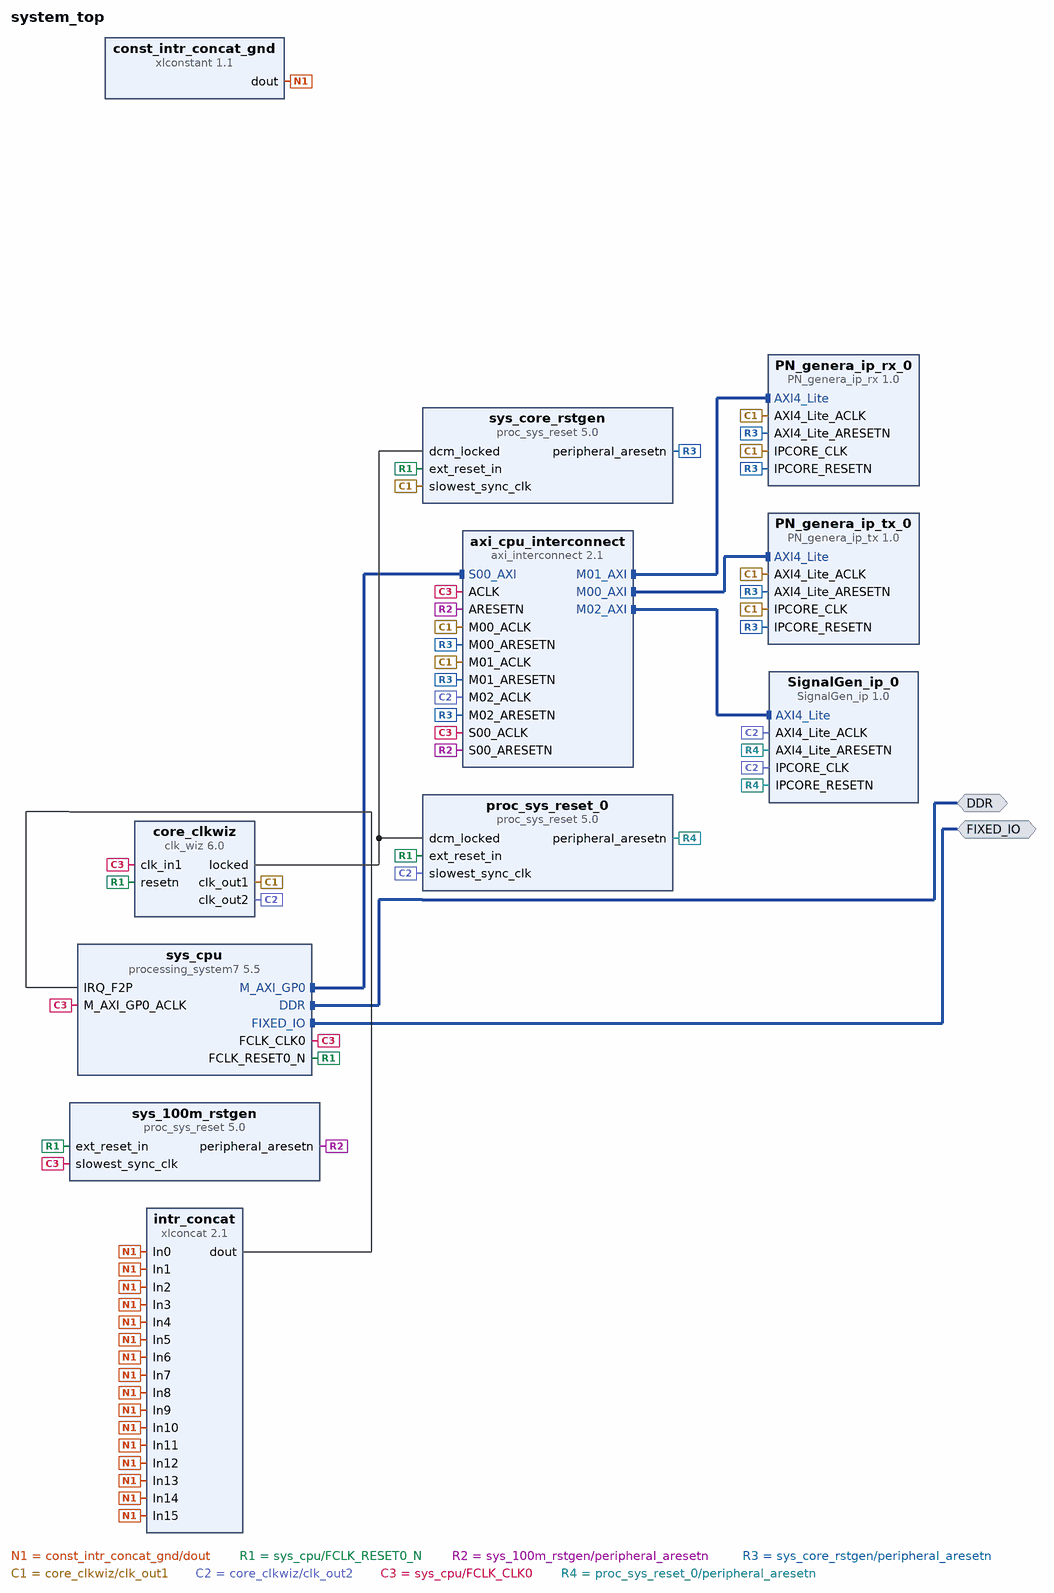
[diagram p0: block diagram of the top level]
# Vivado block design system_top, xc7z020clg484-1, Vivado 2019.1
create_bd_design system_top

create_bd_intf_port -mode Master -vlnv xilinx.com:interface:ddrx_rtl:1.0 DDR
create_bd_intf_port -mode Master -vlnv xilinx.com:display_processing_system7:fixedio_rtl:1.0 FIXED_IO

create_bd_cell -type ip -vlnv xilinx.com:ip:axi_interconnect:2.1 axi_cpu_interconnect
set_property -dict {CONFIG.NUM_MI 3 CONFIG.S00_HAS_REGSLICE 4} [get_bd_cells axi_cpu_interconnect]
create_bd_cell -type ip -vlnv xilinx.com:ip:xlconstant:1.1 const_intr_concat_gnd
set_property -dict {CONFIG.CONST_VAL 0 CONFIG.CONST_WIDTH 1} [get_bd_cells const_intr_concat_gnd]
create_bd_cell -type ip -vlnv xilinx.com:ip:clk_wiz:6.0 core_clkwiz
set_property -dict [list \
  CONFIG.CLKOUT1_JITTER 209.588 \
  CONFIG.CLKOUT1_PHASE_ERROR 98.575 \
  CONFIG.CLKOUT1_REQUESTED_OUT_FREQ 10.000 \
  CONFIG.CLKOUT2_JITTER 151.636 \
  CONFIG.CLKOUT2_PHASE_ERROR 98.575 \
  CONFIG.CLKOUT2_REQUESTED_OUT_FREQ 50 \
  CONFIG.CLKOUT2_USED true \
  CONFIG.MMCM_CLKFBOUT_MULT_F 10.000 \
  CONFIG.MMCM_CLKOUT0_DIVIDE_F 100.000 \
  CONFIG.MMCM_CLKOUT1_DIVIDE 20 \
  CONFIG.MMCM_DIVCLK_DIVIDE 1 \
  CONFIG.NUM_OUT_CLKS 2 \
  CONFIG.PRIM_SOURCE Global_buffer \
  CONFIG.RESET_TYPE ACTIVE_LOW \
] [get_bd_cells core_clkwiz]
create_bd_cell -type ip -vlnv xilinx.com:ip:xlconcat:2.1 intr_concat
set_property -dict {CONFIG.NUM_PORTS 16} [get_bd_cells intr_concat]
create_bd_cell -type ip -vlnv xilinx.com:ip:proc_sys_reset:5.0 sys_100m_rstgen
set_property -dict {CONFIG.C_EXT_RST_WIDTH 1} [get_bd_cells sys_100m_rstgen]
create_bd_cell -type ip -vlnv xilinx.com:ip:proc_sys_reset:5.0 sys_core_rstgen
set_property -dict {CONFIG.C_EXT_RST_WIDTH 1} [get_bd_cells sys_core_rstgen]
create_bd_cell -type ip -vlnv xilinx.com:ip:processing_system7:5.5 sys_cpu
set_property -dict [list \
  CONFIG.PCW_APU_PERIPHERAL_FREQMHZ 666.666667 \
  CONFIG.PCW_ENET0_ENET0_IO {MIO 16 .. 27} \
  CONFIG.PCW_ENET0_GRP_MDIO_ENABLE 1 \
  CONFIG.PCW_ENET0_GRP_MDIO_IO {MIO 52 .. 53} \
  CONFIG.PCW_ENET0_PERIPHERAL_ENABLE 1 \
  CONFIG.PCW_ENET0_RESET_ENABLE 0 \
  CONFIG.PCW_ENET_RESET_ENABLE 1 \
  CONFIG.PCW_ENET_RESET_SELECT {Share reset pin} \
  CONFIG.PCW_EN_CLK1_PORT 1 \
  CONFIG.PCW_EN_RST1_PORT 1 \
  CONFIG.PCW_FCLK_CLK1_BUF TRUE \
  CONFIG.PCW_FPGA0_PERIPHERAL_FREQMHZ 100.0 \
  CONFIG.PCW_FPGA1_PERIPHERAL_FREQMHZ 200.0 \
  CONFIG.PCW_FPGA_FCLK1_ENABLE 1 \
  CONFIG.PCW_GPIO_EMIO_GPIO_ENABLE 1 \
  CONFIG.PCW_GPIO_EMIO_GPIO_IO 32 \
  CONFIG.PCW_GPIO_EMIO_GPIO_WIDTH 32 \
  CONFIG.PCW_GPIO_MIO_GPIO_ENABLE 1 \
  CONFIG.PCW_GPIO_MIO_GPIO_IO MIO \
  CONFIG.PCW_I2C_RESET_ENABLE 1 \
  CONFIG.PCW_IRQ_F2P_INTR 1 \
  CONFIG.PCW_PRESET_BANK1_VOLTAGE {LVCMOS 1.8V} \
  CONFIG.PCW_QSPI_GRP_SINGLE_SS_ENABLE 1 \
  CONFIG.PCW_QSPI_GRP_SINGLE_SS_IO {MIO 1 .. 6} \
  CONFIG.PCW_QSPI_PERIPHERAL_ENABLE 1 \
  CONFIG.PCW_QSPI_QSPI_IO {MIO 1 .. 6} \
  CONFIG.PCW_SD0_GRP_CD_ENABLE 1 \
  CONFIG.PCW_SD0_GRP_CD_IO {MIO 47} \
  CONFIG.PCW_SD0_GRP_WP_ENABLE 1 \
  CONFIG.PCW_SD0_GRP_WP_IO {MIO 46} \
  CONFIG.PCW_SD0_PERIPHERAL_ENABLE 1 \
  CONFIG.PCW_SD0_SD0_IO {MIO 40 .. 45} \
  CONFIG.PCW_SDIO_PERIPHERAL_FREQMHZ 50 \
  CONFIG.PCW_SINGLE_QSPI_DATA_MODE x4 \
  CONFIG.PCW_UART1_PERIPHERAL_ENABLE 1 \
  CONFIG.PCW_UART1_UART1_IO {MIO 48 .. 49} \
  CONFIG.PCW_UART_PERIPHERAL_FREQMHZ 50 \
  CONFIG.PCW_UIPARAM_DDR_FREQ_MHZ 533.333313 \
  CONFIG.PCW_UIPARAM_DDR_PARTNO {MT41J128M16 HA-15E} \
  CONFIG.PCW_USB0_PERIPHERAL_ENABLE 1 \
  CONFIG.PCW_USB0_RESET_ENABLE 0 \
  CONFIG.PCW_USB0_USB0_IO {MIO 28 .. 39} \
  CONFIG.PCW_USB_RESET_ENABLE 1 \
  CONFIG.PCW_USB_RESET_SELECT {Share reset pin} \
  CONFIG.PCW_USE_FABRIC_INTERRUPT 1 \
  CONFIG.preset ZedBoard \
] [get_bd_cells sys_cpu]
# 225 more settings of sys_cpu are not shown: defaults, MIO pin electricals, DDR timing, and values the tool derives
create_bd_cell -type ip -vlnv xilinx.com:ip:PN_genera_ip_tx:1.0 PN_genera_ip_tx_0
create_bd_cell -type ip -vlnv xilinx.com:ip:PN_genera_ip_rx:1.0 PN_genera_ip_rx_0
create_bd_cell -type ip -vlnv xilinx.com:ip:SignalGen_ip:1.0 SignalGen_ip_0
create_bd_cell -type ip -vlnv xilinx.com:ip:proc_sys_reset:5.0 proc_sys_reset_0

# ---- connections ----

connect_bd_intf_net [get_bd_intf_pins axi_cpu_interconnect/M01_AXI] [get_bd_intf_pins PN_genera_ip_rx_0/AXI4_Lite]
connect_bd_intf_net [get_bd_intf_ports DDR] [get_bd_intf_pins sys_cpu/DDR]
connect_bd_intf_net [get_bd_intf_pins axi_cpu_interconnect/S00_AXI] [get_bd_intf_pins sys_cpu/M_AXI_GP0]
connect_bd_intf_net [get_bd_intf_ports FIXED_IO] [get_bd_intf_pins sys_cpu/FIXED_IO]
connect_bd_intf_net [get_bd_intf_pins PN_genera_ip_tx_0/AXI4_Lite] [get_bd_intf_pins axi_cpu_interconnect/M00_AXI]
connect_bd_intf_net [get_bd_intf_pins axi_cpu_interconnect/M02_AXI] [get_bd_intf_pins SignalGen_ip_0/AXI4_Lite]
connect_bd_net -net const_intr_concat_gnd [get_bd_pins const_intr_concat_gnd/dout] \
  [get_bd_pins intr_concat/In0] [get_bd_pins intr_concat/In1] [get_bd_pins intr_concat/In2] [get_bd_pins intr_concat/In3] \
  [get_bd_pins intr_concat/In4] [get_bd_pins intr_concat/In5] [get_bd_pins intr_concat/In6] [get_bd_pins intr_concat/In7] \
  [get_bd_pins intr_concat/In8] [get_bd_pins intr_concat/In9] [get_bd_pins intr_concat/In10] [get_bd_pins intr_concat/In11] \
  [get_bd_pins intr_concat/In12] [get_bd_pins intr_concat/In13] [get_bd_pins intr_concat/In14] [get_bd_pins intr_concat/In15]
connect_bd_net -net core_clkwiz_locked_net [get_bd_pins core_clkwiz/locked] \
  [get_bd_pins sys_core_rstgen/dcm_locked] [get_bd_pins proc_sys_reset_0/dcm_locked]
connect_bd_net [get_bd_pins intr_concat/dout] [get_bd_pins sys_cpu/IRQ_F2P]
connect_bd_net -net proc_100m_resetn [get_bd_pins sys_cpu/FCLK_RESET0_N] \
  [get_bd_pins core_clkwiz/resetn] [get_bd_pins sys_100m_rstgen/ext_reset_in] [get_bd_pins sys_core_rstgen/ext_reset_in] \
  [get_bd_pins proc_sys_reset_0/ext_reset_in]
connect_bd_net -net sys_100m_resetn [get_bd_pins sys_100m_rstgen/peripheral_aresetn] \
  [get_bd_pins axi_cpu_interconnect/ARESETN] [get_bd_pins axi_cpu_interconnect/S00_ARESETN]
connect_bd_net -net sys_core_resetn [get_bd_pins sys_core_rstgen/peripheral_aresetn] \
  [get_bd_pins axi_cpu_interconnect/M00_ARESETN] [get_bd_pins PN_genera_ip_tx_0/AXI4_Lite_ARESETN] \
  [get_bd_pins PN_genera_ip_tx_0/IPCORE_RESETN] [get_bd_pins axi_cpu_interconnect/M01_ARESETN] \
  [get_bd_pins axi_cpu_interconnect/M02_ARESETN] [get_bd_pins PN_genera_ip_rx_0/AXI4_Lite_ARESETN] \
  [get_bd_pins PN_genera_ip_rx_0/IPCORE_RESETN]
connect_bd_net [get_bd_pins core_clkwiz/clk_out1] \
  [get_bd_pins sys_core_rstgen/slowest_sync_clk] [get_bd_pins axi_cpu_interconnect/M01_ACLK] \
  [get_bd_pins axi_cpu_interconnect/M00_ACLK] [get_bd_pins PN_genera_ip_rx_0/IPCORE_CLK] \
  [get_bd_pins PN_genera_ip_rx_0/AXI4_Lite_ACLK] [get_bd_pins PN_genera_ip_tx_0/IPCORE_CLK] \
  [get_bd_pins PN_genera_ip_tx_0/AXI4_Lite_ACLK]
connect_bd_net [get_bd_pins core_clkwiz/clk_out2] \
  [get_bd_pins axi_cpu_interconnect/M02_ACLK] [get_bd_pins SignalGen_ip_0/AXI4_Lite_ACLK] \
  [get_bd_pins SignalGen_ip_0/IPCORE_CLK] [get_bd_pins proc_sys_reset_0/slowest_sync_clk]
connect_bd_net [get_bd_pins sys_cpu/FCLK_CLK0] \
  [get_bd_pins axi_cpu_interconnect/ACLK] [get_bd_pins axi_cpu_interconnect/S00_ACLK] [get_bd_pins core_clkwiz/clk_in1] \
  [get_bd_pins sys_100m_rstgen/slowest_sync_clk] [get_bd_pins sys_cpu/M_AXI_GP0_ACLK]
connect_bd_net [get_bd_pins proc_sys_reset_0/peripheral_aresetn] \
  [get_bd_pins SignalGen_ip_0/IPCORE_RESETN] [get_bd_pins SignalGen_ip_0/AXI4_Lite_ARESETN]

# ---- address map ----
assign_bd_address -offset 0x400D0000 -range 64K -target_address_space [get_bd_addr_spaces sys_cpu/Data] [get_bd_addr_segs PN_genera_ip_tx_0/AXI4_Lite/reg0]
assign_bd_address -offset 0x43C00000 -range 64K -target_address_space [get_bd_addr_spaces sys_cpu/Data] [get_bd_addr_segs PN_genera_ip_rx_0/AXI4_Lite/reg0]
assign_bd_address -offset 0x43C10000 -range 64K -target_address_space [get_bd_addr_spaces sys_cpu/Data] [get_bd_addr_segs SignalGen_ip_0/AXI4_Lite/reg0]

validate_bd_design
save_bd_design
